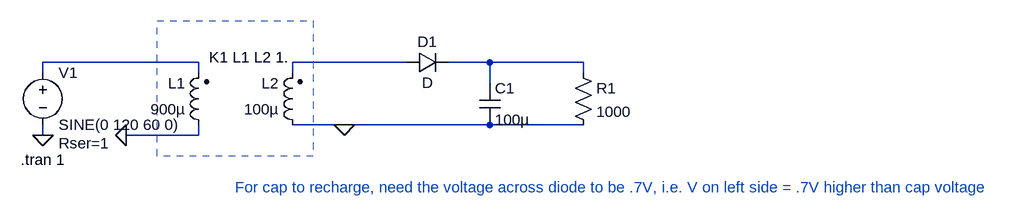
[diagram p0: schematic Peak Rectifier.asc]
Peak Rectifier.asc, the LTspice schematic file:
Version 4
SHEET 1 1536 680
WIRE 224 112 -16 112
WIRE 544 112 368 112
WIRE 672 112 608 112
WIRE 816 112 672 112
WIRE -16 128 -16 112
WIRE 224 128 224 112
WIRE 368 128 368 112
WIRE 816 128 816 112
WIRE 672 144 672 112
WIRE 448 208 368 208
WIRE 672 208 448 208
WIRE 816 208 672 208
WIRE -16 224 -16 208
WIRE 224 224 224 208
WIRE 224 224 112 224
FLAG 448 208 0
FLAG 112 224 0
FLAG -16 224 0
SYMBOL voltage -16 112 R0
WINDOW 123 0 0 Left 0
WINDOW 39 24 124 Left 2
SYMATTR InstName V1
SYMATTR Value SINE(0 120 60 0)
SYMATTR SpiceLine Rser=1
SYMBOL ind2 240 224 R180
WINDOW 0 36 80 Left 2
WINDOW 3 36 40 Left 2
SYMATTR InstName L1
SYMATTR Value 900µ
SYMATTR Type ind
SYMBOL ind2 384 224 R180
WINDOW 0 36 80 Left 2
WINDOW 3 36 40 Left 2
SYMATTR InstName L2
SYMATTR Value 100µ
SYMATTR Type ind
SYMBOL diode 544 128 R270
WINDOW 0 32 32 VTop 2
WINDOW 3 0 32 VBottom 2
SYMATTR InstName D1
SYMBOL cap 656 144 R0
SYMATTR InstName C1
SYMATTR Value 100µ
SYMBOL res 800 112 R0
SYMATTR InstName R1
SYMATTR Value 1000
TEXT 240 104 Left 2 !K1 L1 L2 1.
TEXT -50 262 Left 2 !.tran 1
TEXT 280 304 Left 2 ;For cap to recharge, need the voltage across diode to be .7V, i.e. V on left side = .7V higher than cap voltage
RECTANGLE Normal 400 256 160 48 2

The netlist it stands for:
* Peak Rectifier.asc
V1 N001 0 SINE(0 120 60 0) Rser=1
L1 0 N001 900µ
L2 0 N002 100µ
D1 N002 N003 D
C1 N003 0 100µ
R1 N003 0 1000
.model D D
.lib standard.dio
K1 L1 L2 1.
.tran 1
* For cap to recharge, need the voltage across diode to be .7V, i.e. V on left side = .7V higher than cap voltage
.backanno
.end